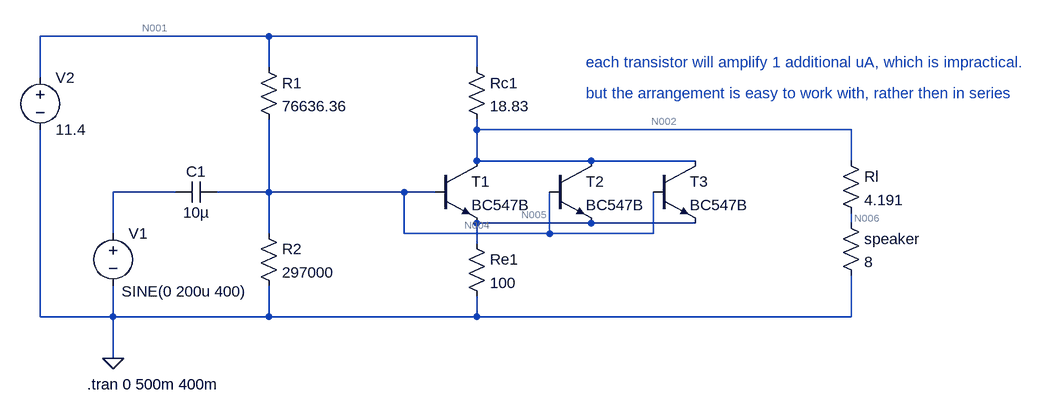
[diagram p0: schematic amplifier-rounded.asc]
amplifier-rounded.asc, the LTspice schematic file:
Version 4
SHEET 1 1720 680
WIRE 16 16 -336 16
WIRE 336 16 16 16
WIRE 16 64 16 16
WIRE 336 64 336 16
WIRE -336 80 -336 16
WIRE 336 160 336 144
WIRE 912 160 336 160
WIRE 336 208 336 160
WIRE 512 208 336 208
WIRE 672 208 512 208
WIRE 912 208 912 160
WIRE -128 256 -224 256
WIRE 16 256 16 144
WIRE 16 256 -64 256
WIRE 224 256 16 256
WIRE 272 256 224 256
WIRE 512 304 336 304
WIRE 672 304 512 304
WIRE 912 304 912 288
WIRE -224 320 -224 256
WIRE 16 320 16 256
WIRE 224 320 224 256
WIRE 448 320 448 256
WIRE 448 320 224 320
WIRE 608 320 608 256
WIRE 608 320 448 320
WIRE 336 336 336 304
WIRE -336 448 -336 160
WIRE -224 448 -224 400
WIRE -224 448 -336 448
WIRE 16 448 16 400
WIRE 16 448 -224 448
WIRE 336 448 336 416
WIRE 336 448 16 448
WIRE 912 448 912 384
WIRE 912 448 336 448
WIRE -224 512 -224 448
FLAG -224 512 0
SYMBOL npn 272 208 R0
SYMATTR InstName T1
SYMATTR Value BC547B
SYMBOL voltage -224 304 R0
WINDOW 123 24 124 Left 2
WINDOW 39 0 0 Left 0
WINDOW 3 13 105 Left 2
SYMATTR Value SINE(0 200u 400)
SYMATTR InstName V1
SYMBOL voltage -336 64 R0
WINDOW 123 0 0 Left 0
WINDOW 39 0 0 Left 0
SYMATTR InstName V2
SYMATTR Value 11.4
SYMBOL res 0 48 R0
SYMATTR InstName R1
SYMATTR Value 76636.36
SYMBOL res 0 304 R0
SYMATTR InstName R2
SYMATTR Value 297000
SYMBOL res 320 48 R0
SYMATTR InstName Rc1
SYMATTR Value 18.83
SYMBOL res 896 192 R0
SYMATTR InstName Rl
SYMATTR Value 4.191
SYMBOL res 896 288 R0
SYMATTR InstName speaker
SYMATTR Value 8
SYMATTR SpiceLine pwr=1
SYMBOL cap -128 272 R270
WINDOW 0 32 32 VTop 2
WINDOW 3 0 32 VBottom 2
SYMATTR InstName C1
SYMATTR Value 10µ
SYMBOL res 320 320 R0
SYMATTR InstName Re1
SYMATTR Value 100
SYMBOL npn 448 208 R0
SYMATTR InstName T2
SYMATTR Value BC547B
SYMBOL npn 608 208 R0
SYMATTR InstName T3
SYMATTR Value BC547B
TEXT -264 552 Left 2 !.tran 0 500m 400m
TEXT 504 56 Left 2 ;each transistor will amplify 1 additional uA, which is impractical.
TEXT 504 104 Left 2 ;but the arrangement is easy to work with, rather then in series

The netlist it stands for:
* amplifier-rounded.asc
Q§T1 N002 N004 N005 0 BC547B
V1 N003 0 SINE(0 200u 400)
V2 N001 0 11.4
R1 N001 N004 76636.36
R2 N004 0 297000
Rc1 N001 N002 18.83
Rl N002 N006 4.191
R§speaker N006 0 8 pwr=1
C1 N003 N004 10µ
Re1 N005 0 100
Q§T2 N002 N004 N005 0 BC547B
Q§T3 N002 N004 N005 0 BC547B
.model NPN NPN
.model PNP PNP
.lib standard.bjt
.tran 0 500m 400m
* each transistor will amplify 1 additional uA, which is impractical.
* but the arrangement is easy to work with, rather then in series
.backanno
.end

* Results of the author's LTspice run, read from the files saved beside the schematic
* Operating Point, zero values left out:
*   V(n002) = 4.289 V
*   V(n004) = 3.29 V
*   V(n005) = 2.59 V
*   V(n001) = 11.4 V
*   V(n006) = 2.815 V
*   Ic(T3) = 8.601 mA
*   Ib(T3) = 31.58 µA
*   Ie(T3) = -8.633 mA
*   Ic(T2) = 8.601 mA
*   Ib(T2) = 31.58 µA
*   Ie(T2) = -8.633 mA
*   Ic(T1) = 8.601 mA
*   Ib(T1) = 31.58 µA
*   Ie(T1) = -8.633 mA
*   I(Re1) = 25.9 mA
*   I(Speaker) = 351.8 mA
*   I(Rl) = 351.8 mA
*   I(Rc1) = 377.6 mA
*   I(R2) = 11.08 µA
*   I(R1) = 105.8 µA
*   I(V2) = -377.7 mA
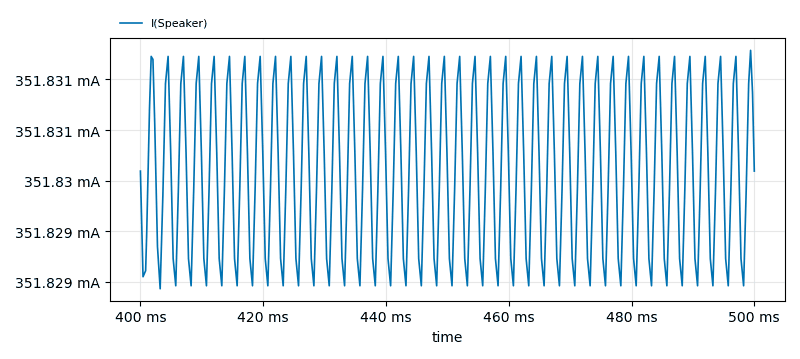
[diagram p1: Transient Analysis of amplifier-rounded.asc, plotted from the saved traces]
* Transient Analysis, 1 run:
*   I(Speaker): min 351.8 mA, max 351.8 mA, average 351.8 mA, rms 351.8 mA, last 351.8 mA